# EAGLE design Backplane (EAGLE 9.5.2)

## Sheet 1 of 2
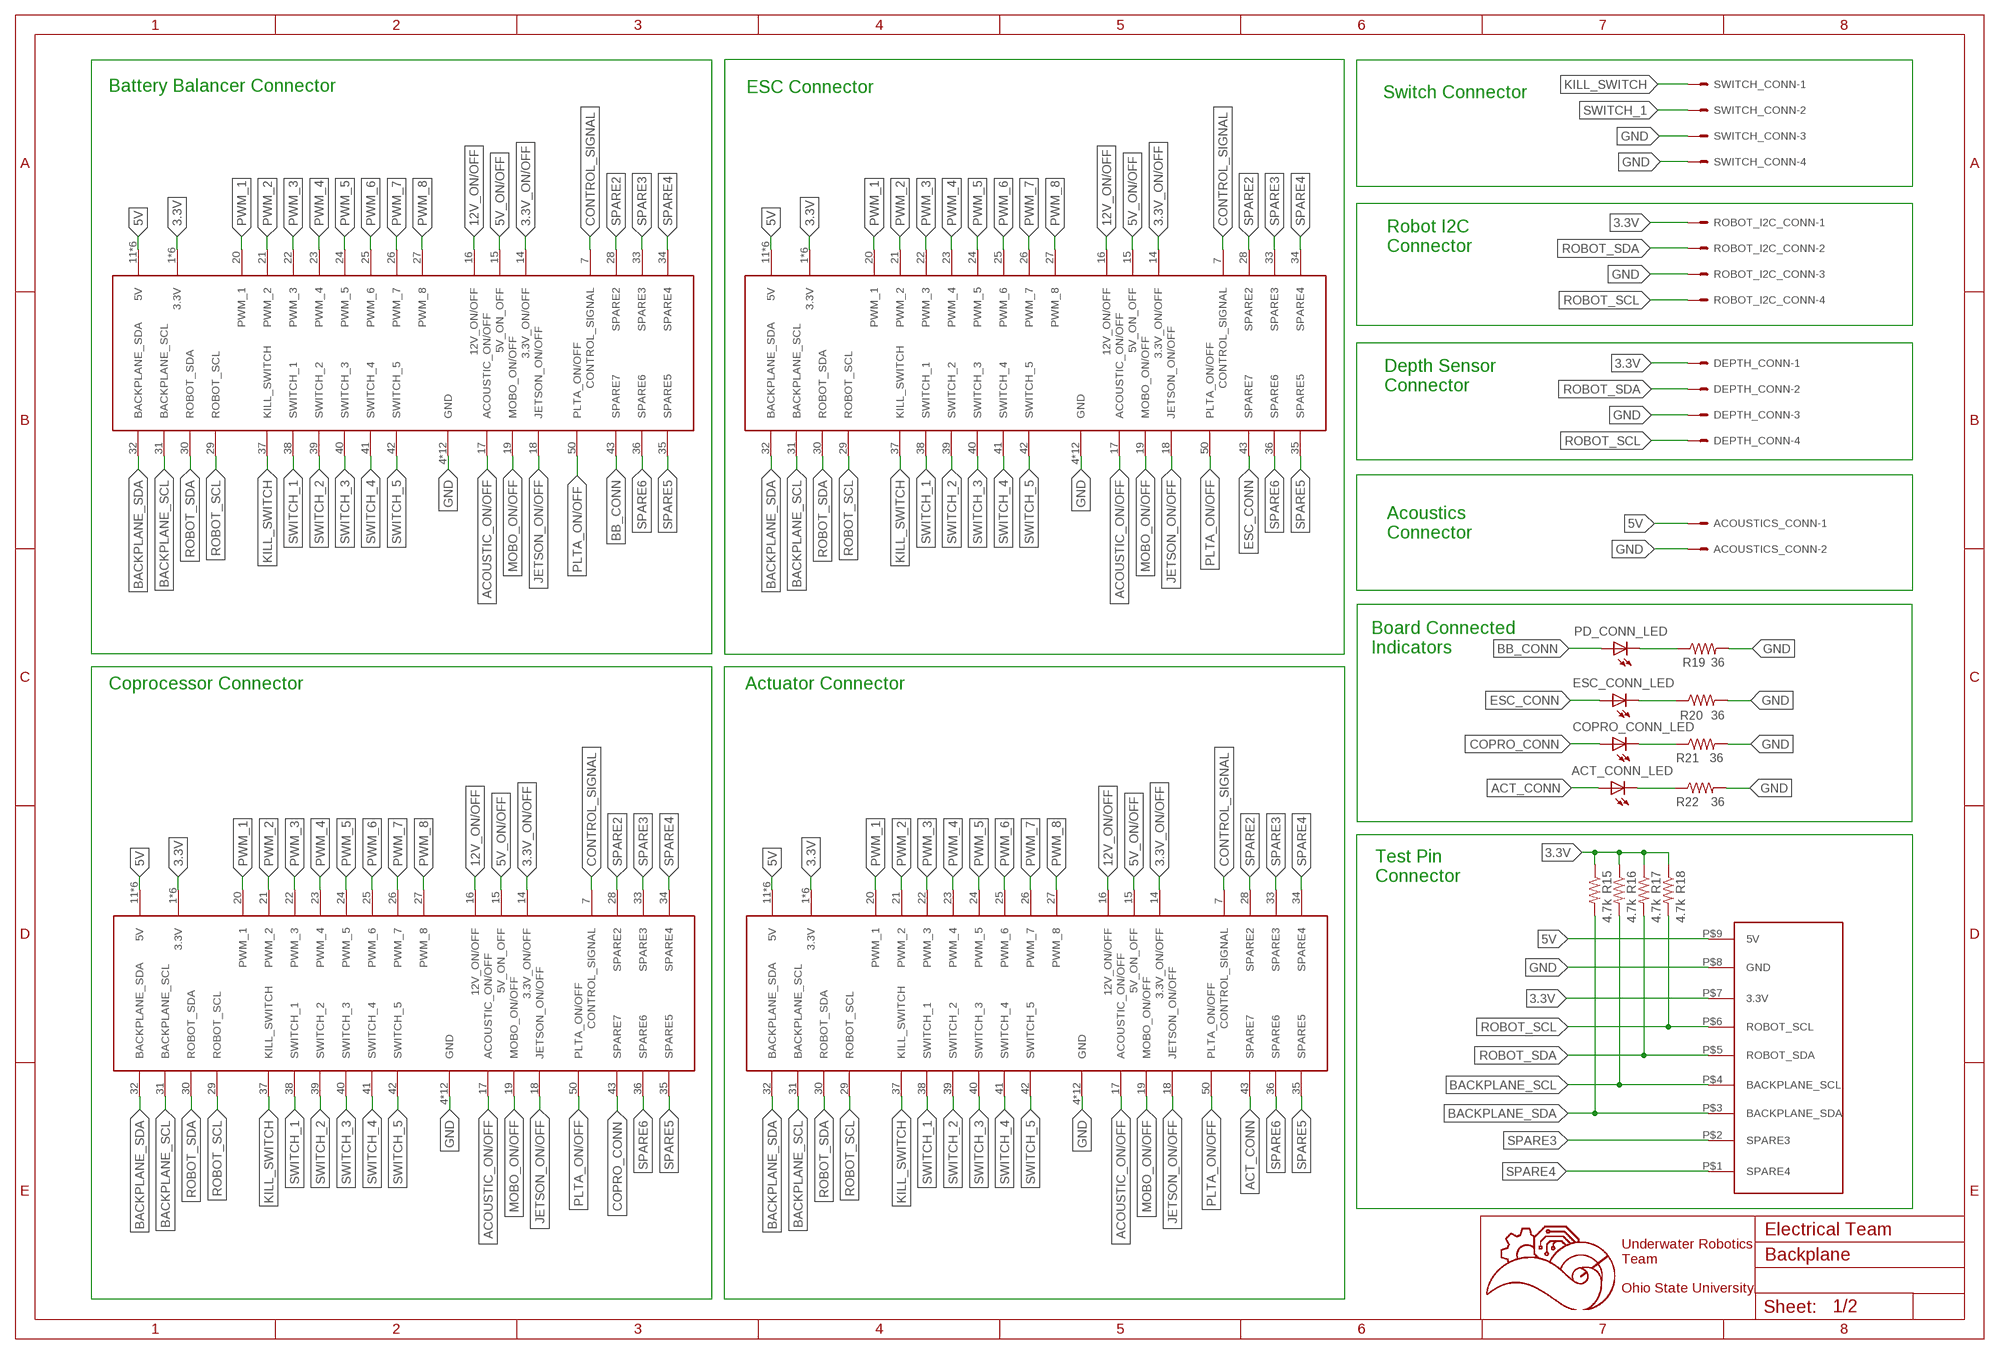
[diagram p0: schematic, sheet 1]

### Parts
ACOUSTICS_CONN  555X-2V  [5566-2]
ACT_CONN_LED  LEDCHIP-LED0603  [CHIP-LED0603]
COPRO_CONN_LED  LEDCHIP-LED0603  [CHIP-LED0603]
DEPTH_CONN  555X-4V  [5566-4]
ESC_CONN_LED  LEDCHIP-LED0603  [CHIP-LED0603]
PD_CONN_LED  LEDCHIP-LED0603  [CHIP-LED0603]
R15  4.7k  R-US_R0603  [R0603]
R16  4.7k  R-US_R0603  [R0603]
R17  4.7k  R-US_R0603  [R0603]
R18  4.7k  R-US_R0603  [R0603]
R19  36  R-US_R0603  [R0603]
R20  36  R-US_R0603  [R0603]
R21  36  R-US_R0603  [R0603]
R22  36  R-US_R0603  [R0603]
ROBOT_I2C_CONN  555X-4V  [5566-4]
SWITCH_CONN  555X-4V  [5566-4]
TESTPIN_CONNECTOR  929870-01-09_4  [929852-01-09_1ROW]
U$1  5530843-FEMALE  [5530843-6-BACKPLANEMATE]
U$2  5530843-FEMALE  [5530843-6-BACKPLANEMATE]
U$3  5530843-FEMALE  [5530843-6-BACKPLANEMATE]
U$4  5530843-FEMALE  [5530843-6-BACKPLANEMATE]

### Nets
3.3V: DEPTH_CONN.1 R15.1 R16.1 R17.1 R18.1 ROBOT_I2C_CONN.1 TESTPIN_CONNECTOR.P$7(3.3V) U$1.1(3.3V) U$1.2(3.3V) U$1.3(3.3V) U$1.54(3.3V) U$1.55(3.3V) U$1.56(3.3V) U$2.1(3.3V) U$2.2(3.3V) U$2.3(3.3V) U$2.54(3.3V) U$2.55(3.3V) U$2.56(3.3V) U$3.1(3.3V) U$3.2(3.3V) U$3.3(3.3V) U$3.54(3.3V) U$3.55(3.3V) U$3.56(3.3V) U$4.1(3.3V) U$4.2(3.3V) U$4.3(3.3V) U$4.54(3.3V) U$4.55(3.3V) U$4.56(3.3V)
3.3V_ON/OFF: U$1.14(3.3V_ON/OFF) U$2.14(3.3V_ON/OFF) U$3.14(3.3V_ON/OFF) U$4.14(3.3V_ON/OFF)
5V: ACOUSTICS_CONN.1 TESTPIN_CONNECTOR.P$9(5V) U$1.11(5V) U$1.12(5V) U$1.13(5V) U$1.44(5V) U$1.45(5V) U$1.46(5V) U$2.11(5V) U$2.12(5V) U$2.13(5V) U$2.44(5V) U$2.45(5V) U$2.46(5V) U$3.11(5V) U$3.12(5V) U$3.13(5V) U$3.44(5V) U$3.45(5V) U$3.46(5V) U$4.11(5V) U$4.12(5V) U$4.13(5V) U$4.44(5V) U$4.45(5V) U$4.46(5V)
5V_ON/OFF: U$1.15(5V_ON_OFF) U$2.15(5V_ON_OFF) U$3.15(5V_ON_OFF) U$4.15(5V_ON_OFF)
12V_ON/OFF: U$1.16(12V_ON/OFF) U$2.16(12V_ON/OFF) U$3.16(12V_ON/OFF) U$4.16(12V_ON/OFF)
ACOUSTIC_ON/OFF: U$1.17(ACOUSTIC_ON/OFF) U$2.17(ACOUSTIC_ON/OFF) U$3.17(ACOUSTIC_ON/OFF) U$4.17(ACOUSTIC_ON/OFF)
ACT_CONN: ACT_CONN_LED.A U$4.43(SPARE7)
BACKPLANE_SCL: R16.2 TESTPIN_CONNECTOR.P$4(BACKPLANE_SCL) U$1.31(BACKPLANE_SCL) U$2.31(BACKPLANE_SCL) U$3.31(BACKPLANE_SCL) U$4.31(BACKPLANE_SCL)
BACKPLANE_SDA: R15.2 TESTPIN_CONNECTOR.P$3(BACKPLANE_SDA) U$1.32(BACKPLANE_SDA) U$2.32(BACKPLANE_SDA) U$3.32(BACKPLANE_SDA) U$4.32(BACKPLANE_SDA)
BB_CONN: PD_CONN_LED.A U$1.43(SPARE7)
CONTROL_SIGNAL: U$1.7(CONTROL_SIGNAL) U$2.7(CONTROL_SIGNAL) U$3.7(CONTROL_SIGNAL) U$4.7(CONTROL_SIGNAL)
COPRO_CONN: COPRO_CONN_LED.A U$3.43(SPARE7)
ESC_CONN: ESC_CONN_LED.A U$2.43(SPARE7)
GND: ACOUSTICS_CONN.2 DEPTH_CONN.3 R19.2 R20.2 R21.2 R22.2 ROBOT_I2C_CONN.3 SWITCH_CONN.3 SWITCH_CONN.4 TESTPIN_CONNECTOR.P$8(GND) U$1.4(GND) U$1.5(GND) U$1.6(GND) U$1.8(GND) U$1.9(GND) U$1.10(GND) U$1.47(GND) U$1.48(GND) U$1.49(GND) U$1.51(GND) U$1.52(GND) U$1.53(GND) U$2.4(GND) U$2.5(GND) U$2.6(GND) U$2.8(GND) U$2.9(GND) U$2.10(GND) U$2.47(GND) U$2.48(GND) U$2.49(GND) U$2.51(GND) U$2.52(GND) U$2.53(GND) U$3.4(GND) U$3.5(GND) U$3.6(GND) U$3.8(GND) U$3.9(GND) U$3.10(GND) U$3.47(GND) U$3.48(GND) U$3.49(GND) U$3.51(GND) U$3.52(GND) U$3.53(GND) U$4.4(GND) U$4.5(GND) U$4.6(GND) U$4.8(GND) U$4.9(GND) U$4.10(GND) U$4.47(GND) U$4.48(GND) U$4.49(GND) U$4.51(GND) U$4.52(GND) U$4.53(GND)
JETSON_ON/OFF: U$1.18(JETSON_ON/OFF) U$2.18(JETSON_ON/OFF) U$3.18(JETSON_ON/OFF) U$4.18(JETSON_ON/OFF)
KILL_SWITCH: SWITCH_CONN.1 U$1.37(KILL_SWITCH) U$2.37(KILL_SWITCH) U$3.37(KILL_SWITCH) U$4.37(KILL_SWITCH)
MOBO_ON/OFF: U$1.19(MOBO_ON/OFF) U$2.19(MOBO_ON/OFF) U$3.19(MOBO_ON/OFF) U$4.19(MOBO_ON/OFF)
N$12: PD_CONN_LED.C R19.1
N$13: ESC_CONN_LED.C R20.1
N$14: COPRO_CONN_LED.C R21.1
N$15: ACT_CONN_LED.C R22.1
PLTA_ON/OFF: U$1.50(PLTA_ON/OFF) U$2.50(PLTA_ON/OFF) U$3.50(PLTA_ON/OFF) U$4.50(PLTA_ON/OFF)
PWM_1: U$1.20(PWM_1) U$2.20(PWM_1) U$3.20(PWM_1) U$4.20(PWM_1)
PWM_2: U$1.21(PWM_2) U$2.21(PWM_2) U$3.21(PWM_2) U$4.21(PWM_2)
PWM_3: U$1.22(PWM_3) U$2.22(PWM_3) U$3.22(PWM_3) U$4.22(PWM_3)
PWM_4: U$1.23(PWM_4) U$2.23(PWM_4) U$3.23(PWM_4) U$4.23(PWM_4)
PWM_5: U$1.24(PWM_5) U$2.24(PWM_5) U$3.24(PWM_5) U$4.24(PWM_5)
PWM_6: U$1.25(PWM_6) U$2.25(PWM_6) U$3.25(PWM_6) U$4.25(PWM_6)
PWM_7: U$1.26(PWM_7) U$2.26(PWM_7) U$3.26(PWM_7) U$4.26(PWM_7)
PWM_8: U$1.27(PWM_8) U$2.27(PWM_8) U$3.27(PWM_8) U$4.27(PWM_8)
ROBOT_SCL: DEPTH_CONN.4 R18.2 ROBOT_I2C_CONN.4 TESTPIN_CONNECTOR.P$6(ROBOT_SCL) U$1.29(ROBOT_SCL) U$2.29(ROBOT_SCL) U$3.29(ROBOT_SCL) U$4.29(ROBOT_SCL)
ROBOT_SDA: DEPTH_CONN.2 R17.2 ROBOT_I2C_CONN.2 TESTPIN_CONNECTOR.P$5(ROBOT_SDA) U$1.30(ROBOT_SDA) U$2.30(ROBOT_SDA) U$3.30(ROBOT_SDA) U$4.30(ROBOT_SDA)
SPARE2: U$1.28(SPARE2) U$2.28(SPARE2) U$3.28(SPARE2) U$4.28(SPARE2)
SPARE3: TESTPIN_CONNECTOR.P$2(SPARE3) U$1.33(SPARE3) U$2.33(SPARE3) U$3.33(SPARE3) U$4.33(SPARE3)
SPARE4: TESTPIN_CONNECTOR.P$1(SPARE4) U$1.34(SPARE4) U$2.34(SPARE4) U$3.34(SPARE4) U$4.34(SPARE4)
SPARE5: U$1.35(SPARE5) U$2.35(SPARE5) U$3.35(SPARE5) U$4.35(SPARE5)
SPARE6: U$1.36(SPARE6) U$2.36(SPARE6) U$3.36(SPARE6) U$4.36(SPARE6)
SWITCH_1: SWITCH_CONN.2 U$1.38(SWITCH_1) U$2.38(SWITCH_1) U$3.38(SWITCH_1) U$4.38(SWITCH_1)
SWITCH_2: U$1.39(SWITCH_2) U$2.39(SWITCH_2) U$3.39(SWITCH_2) U$4.39(SWITCH_2)
SWITCH_3: U$1.40(SWITCH_3) U$2.40(SWITCH_3) U$3.40(SWITCH_3) U$4.40(SWITCH_3)
SWITCH_4: U$1.41(SWITCH_4) U$2.41(SWITCH_4) U$3.41(SWITCH_4) U$4.41(SWITCH_4)
SWITCH_5: U$1.42(SWITCH_5) U$2.42(SWITCH_5) U$3.42(SWITCH_5) U$4.42(SWITCH_5)

### Notes on the sheet
- Battery Balancer Connector | ESC Connector
- Switch Connector
- Robot I2C
  Connector
- Depth Sensor
  Connector
- Acoustics
  Connector
- Board Connected 
  Indicators
- Coprocessor Connector | Actuator Connector
- Test Pin
  Connector
- Electrical Team
- Underwater Robotics
  Team
  
  Ohio State University

## Sheet 2 of 2
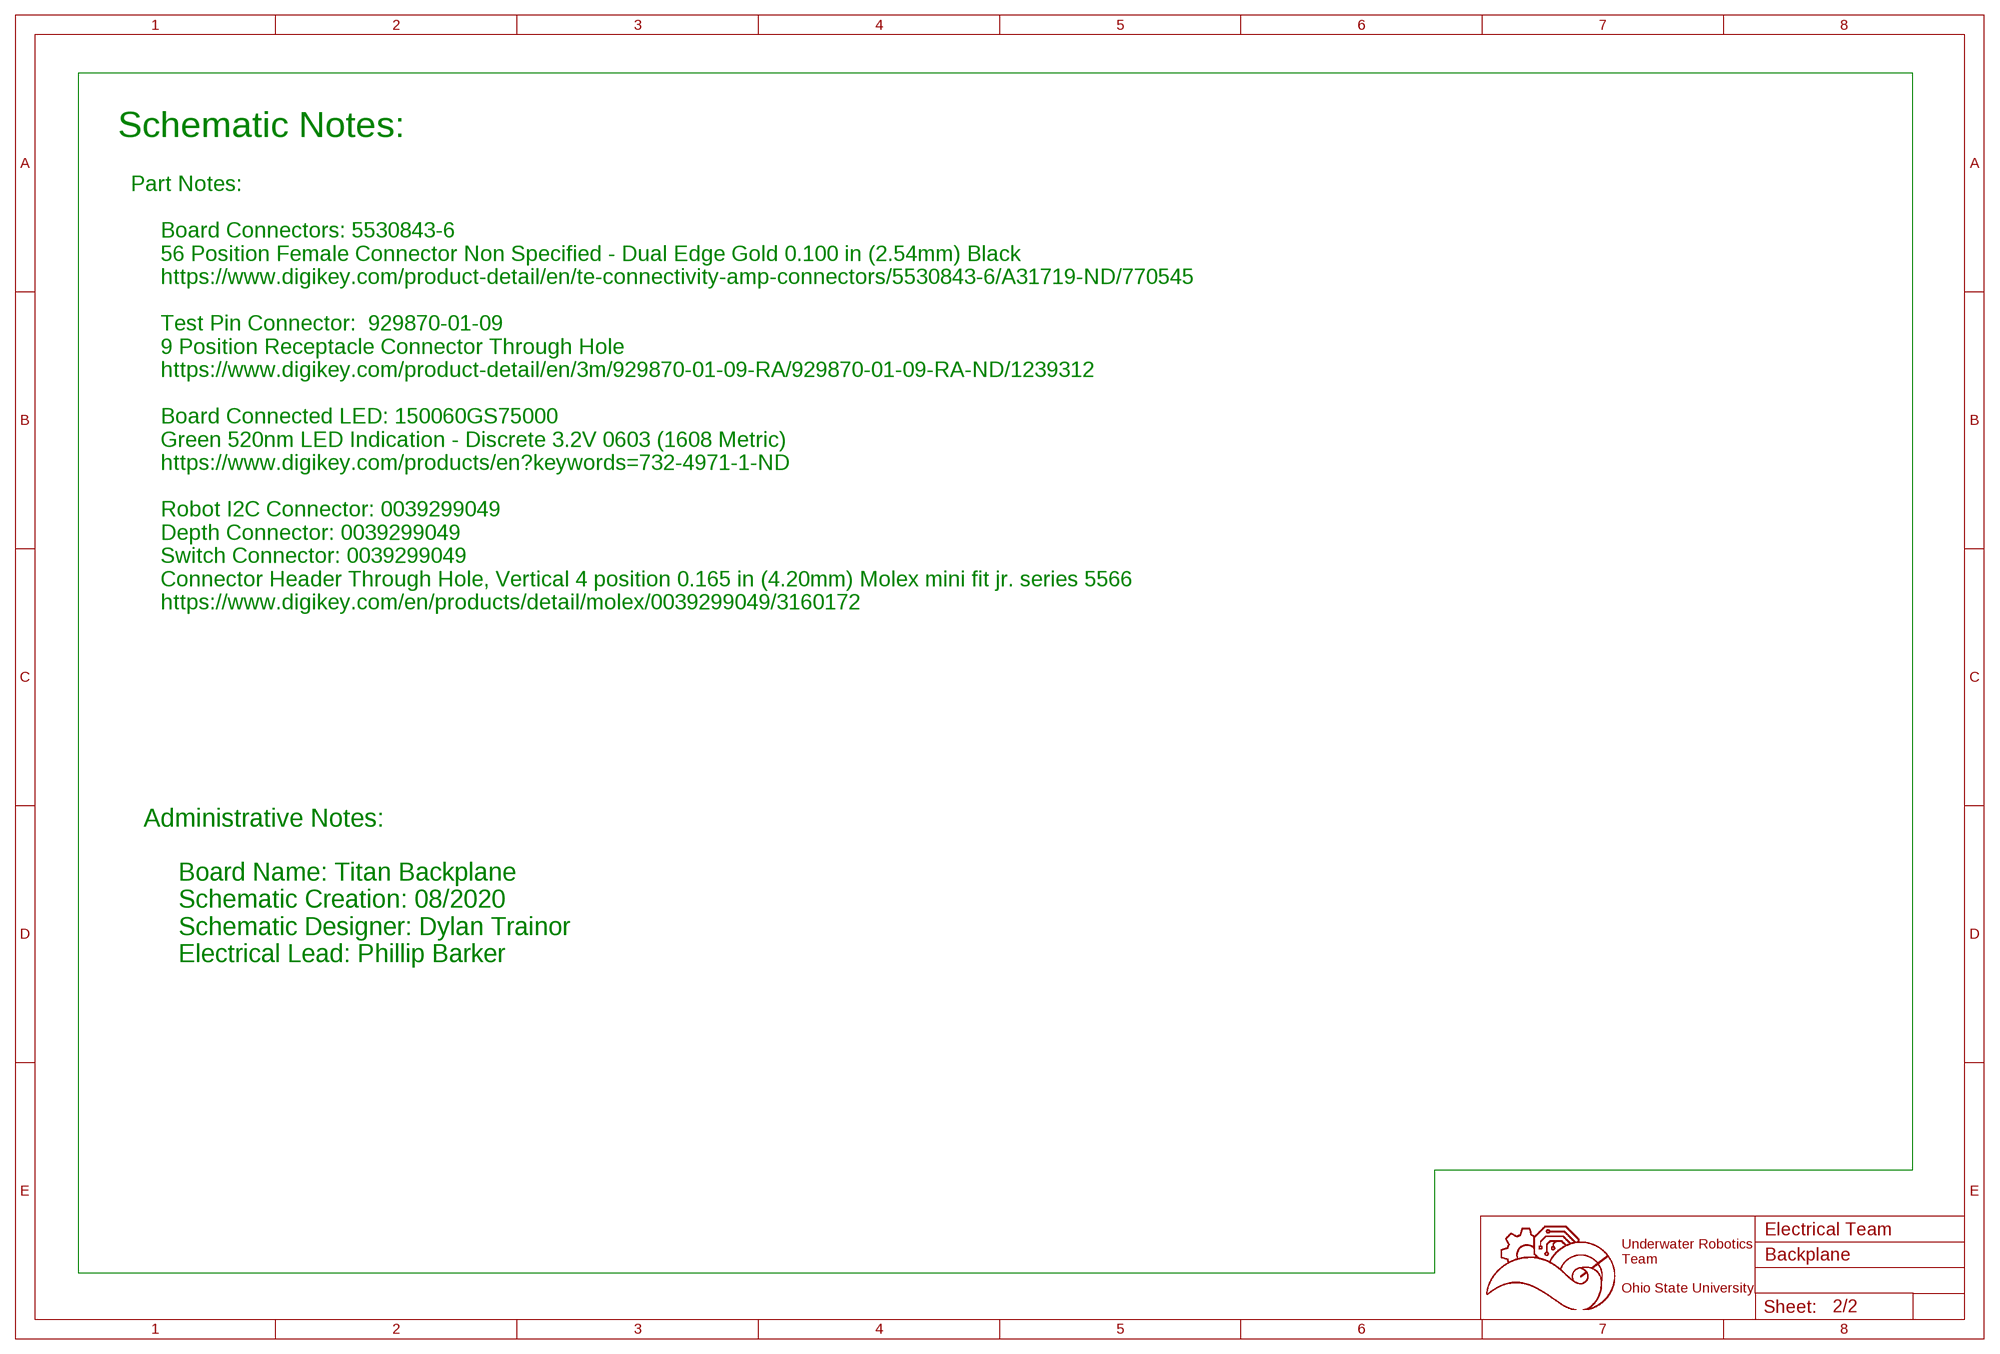
[diagram p1: schematic, sheet 2]

### Notes on the sheet
- Schematic Notes:
- Part Notes:
  
       Board Connectors: 5530843-6
       56 Position Female Connector Non Specified - Dual Edge Gold 0.100 in (2.54mm) Black
       https://www.digikey.com/product-detail/en/te-connectivity-amp-connectors/5530843-6/A31719-ND/770545
  
       Test Pin Connector:  929870-01-09
       9 Position Receptacle Connector Through Hole
       https://www.digikey.com/product-detail/en/3m/929870-01-09-RA/929870-01-09-RA-ND/1239312
  
       Board Connected LED: 150060GS75000
       Green 520nm LED Indication - Discrete 3.2V 0603 (1608 Metric)
       https://www.digikey.com/products/en?keywords=732-4971-1-ND
  
       Robot I2C Connector: 0039299049
       Depth Connector: 0039299049
       Switch Connector: 0039299049
       Connector Header Through Hole, Vertical 4 position 0.165 in (4.20mm) Molex mini fit jr. series 5566
       https://www.digikey.com/en/products/detail/molex/0039299049/3160172
- Administrative Notes:
  
       Board Name: Titan Backplane
       Schematic Creation: 08/2020
       Schematic Designer: Dylan Trainor
       Electrical Lead: Phillip Barker
- Electrical Team
- Underwater Robotics
  Team
  
  Ohio State University

## Library data of the parts
ACOUSTICS_CONN = con-molex-2:555X-2: Mini FIT connector 2 way
ACT_CONN_LED COPRO_CONN_LED ESC_CONN_LED PD_CONN_LED = led:LED: LED OSRAM: - CHIPLED LG R971, LG N971, LY N971, LG Q971, LY Q971, LO R971, LY R971 LH N974, LH R974 LS Q976, LO Q976, LY Q976 LO Q996 - Hyper CHIPLED LW Q18S LB Q993, LB Q99A, LB R99A - SideLED LS A670, LO A670, LY A670, LG A670, LP A670 LB A673, LV A673, LT A673, LW A673 LH A674 LY A675 LS A676, LA A676, LO A676, LY A676, LW A676 LS A679, LY A679, LG A679 - Hyper Micro SIDELED® LS Y876, LA Y876, LO Y876, LY Y876 LT Y87S - SmartLED LW L88C, LW L88S LB L89C, LB L89S, LG L890 LS L89K, LO L89K, LY L89K LS L896, LA L896, LO L896, LY L896 - TOPLED LS T670, LO T670, LY T670, LG T670, LP T670 LSG T670, LSP T670, LSY T670, LOP T670, LYG T670 LG T671, LOG T671, LSG T671 LB T673, LV T673, LT T673, LW T673 LH T674 LS T676, LA T676, LO T676, LY T676, LB T676, LH T676, LSB T676, LW T676 LB T67C, LV T67C, LT T67C, LS T67K, LO T67K, LY T67K, LW E67C LS E67B, LA E67B, LO E67B, LY E67B, LB E67C, LV E67C, LT E67C LW T67C LS T679, LY T679, LG T679 LS T770, LO T770, LY T770, LG T770, LP T770 LB T773, LV T773, LT T773, LW T773 LH T774 LS E675, LA E675, LY E675, LS T675 LS T776, LA T776, LO T776, LY T776, LB T776 LHGB T686 LT T68C, LB T68C - Hyper Mini TOPLED® LB M676 - Mini TOPLED Santana® LG M470 LS M47K, LO M47K, LY M47K Source: http://www.osram.convergy.de LUXEON: - LUMILED® LXK2-PW12-R00, LXK2-PW12-S00, LXK2-PW14-U00, LXK2-PW14-V00 LXK2-PM12-R00, LXK2-PM12-S00, LXK2-PM14-U00 LXK2-PE12-Q00, LXK2-PE12-R00, LXK2-PE12-S00, LXK2-PE14-T00, LXK2-PE14-U00 LXK2-PB12-K00, LXK2-PB12-L00, LXK2-PB12-M00, LXK2-PB14-N00, LXK2-PB14-P00, LXK2-PB14-Q00 LXK2-PR12-L00, LXK2-PR12-M00, LXK2-PR14-Q00, LXK2-PR14-R00 LXK2-PD12-Q00, LXK2-PD12-R00, LXK2-PD12-S00 LXK2-PH12-R00, LXK2-PH12-S00 LXK2-PL12-P00, LXK2-PL12-Q00, LXK2-PL12-R00 Source: www.luxeon.com KINGBRIGHT: KA-3528ASYC Source: www.kingbright.com
DEPTH_CONN ROBOT_I2C_CONN SWITCH_CONN = con-molex-2:555X-4: Mini FIT connector 4 way
R15-R22 = rcl:R-US_: RESISTOR, American symbol; SPICEPREFIX: R
TESTPIN_CONNECTOR = 3M_929852_Connector:929870-01-09_4
U$1-U$4 = 5530843-6:5530843-FEMALE

## Board
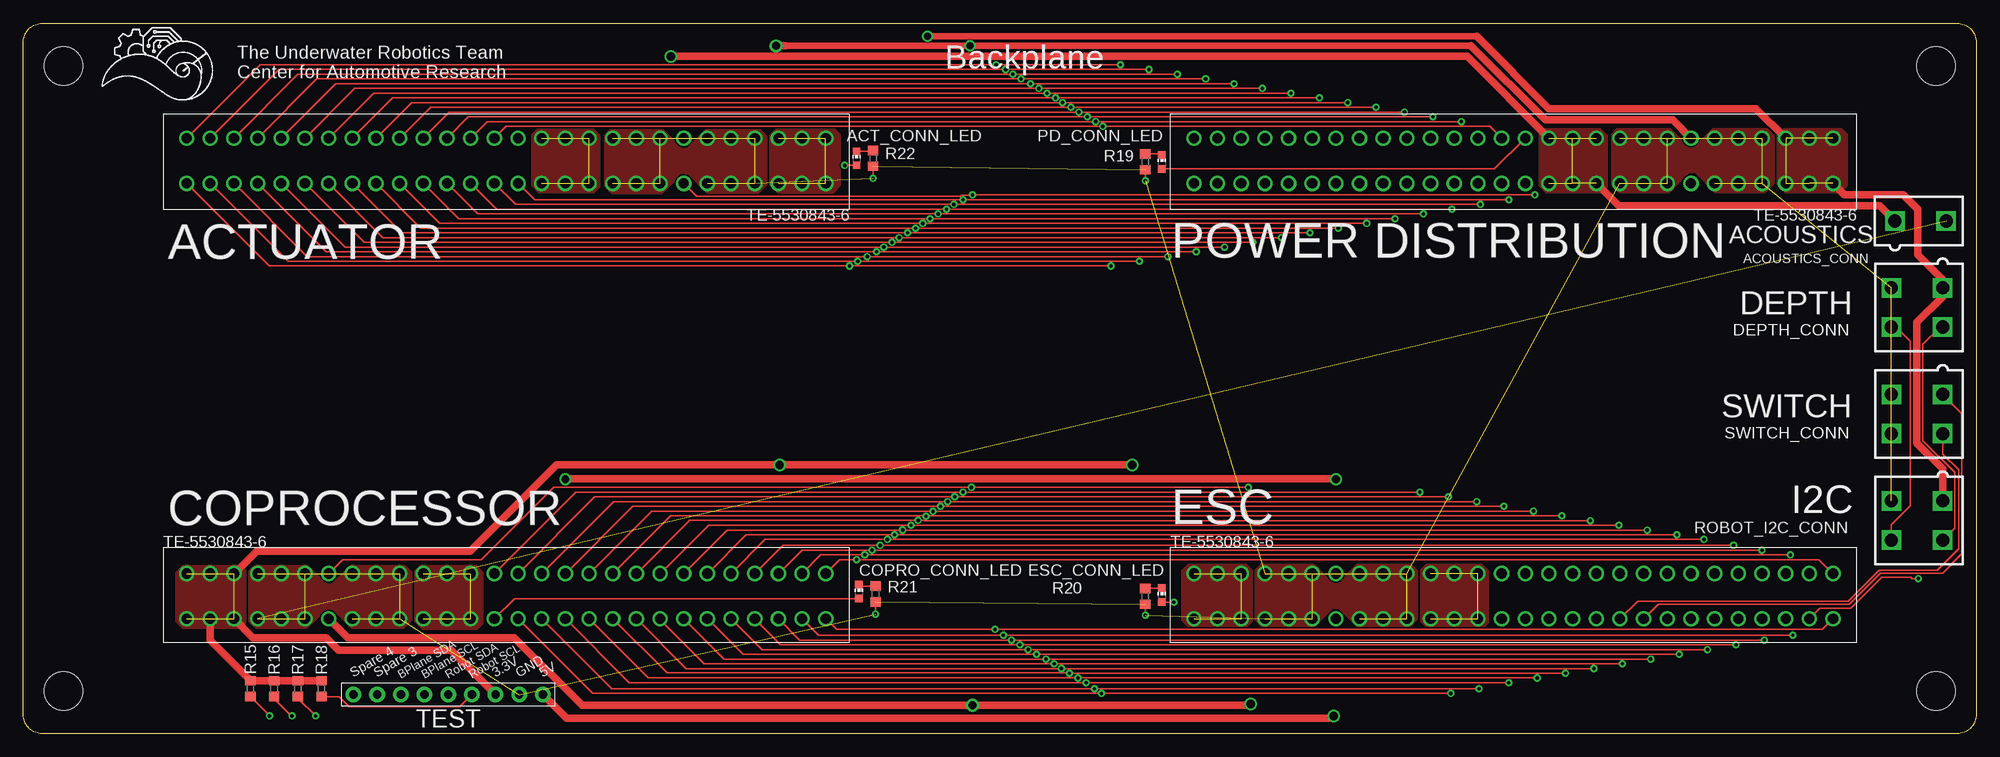
[diagram p2: board, top side]
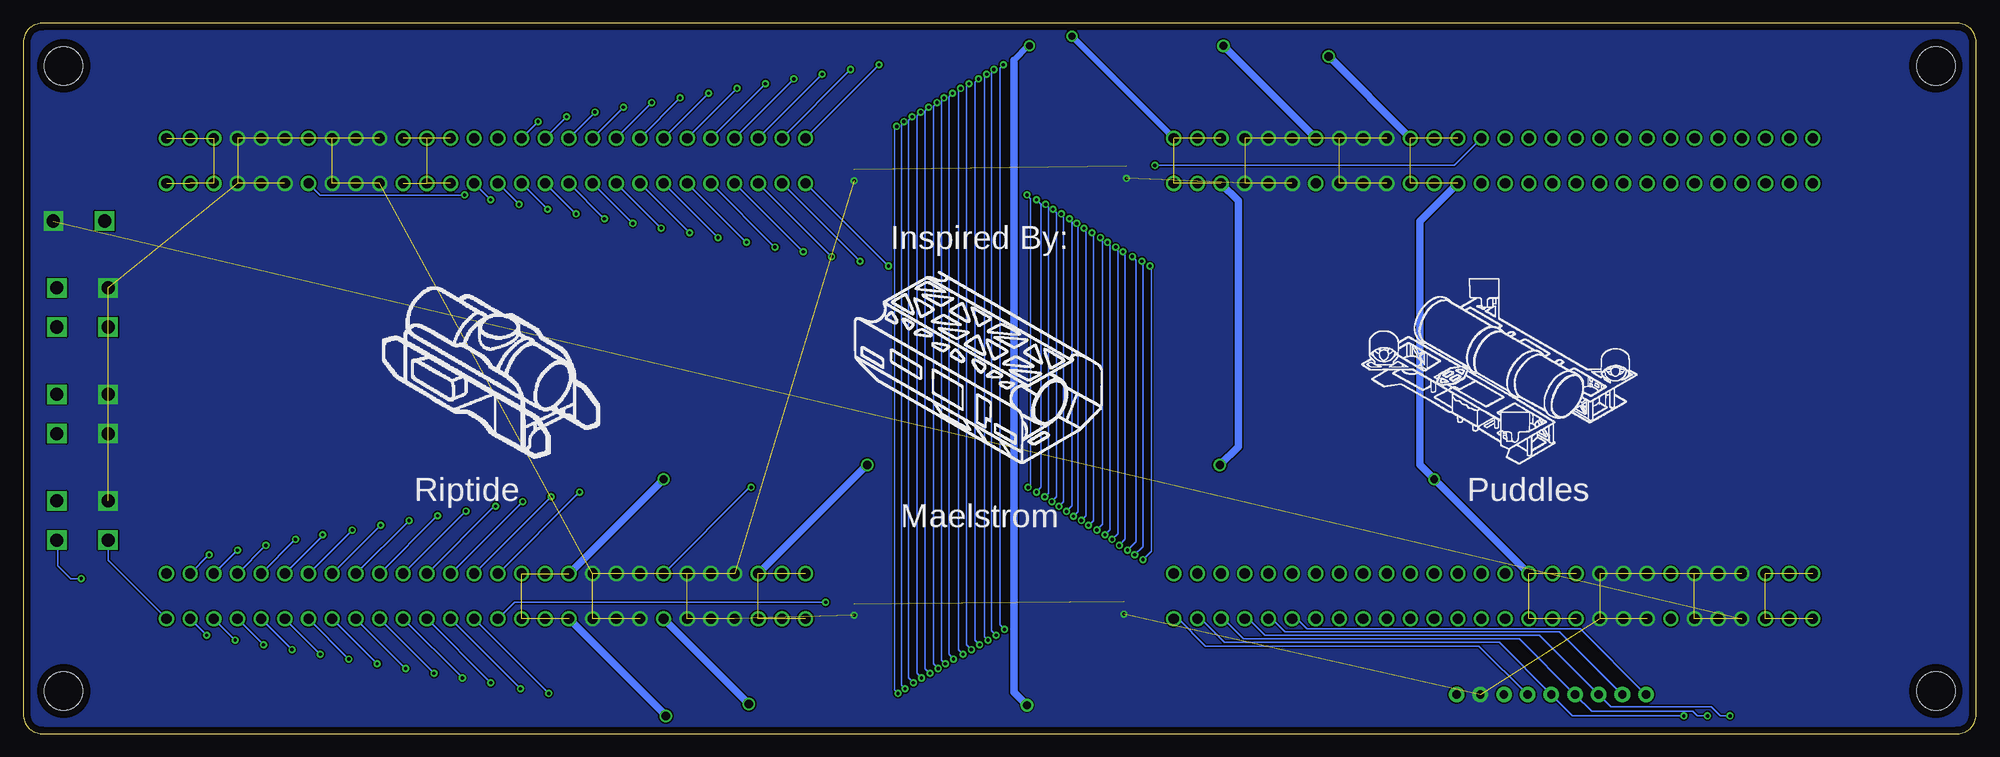
[diagram p3: board, bottom side, seen from below]

Size 209.55 x 76.2 mm. Coordinates in mm from the lower left corner, seen from the top.
Outline: 207.52,0 2.03,0 arc-90 0,2.03 0,74.17 arc-90 2.03,76.2 207.52,76.2 arc-90 209.55,74.17 209.55,2.03 arc-90 207.52,0
Copper layers (1*16): Top 0.035mm / dielectric 1.5mm / Bottom 0.035mm
Design rules "default *": minimum track width 6mil, minimum drill 0.35mm, track to track 6mil, track to pad 6mil, pad to pad 6mil, via to via 6mil, smd to smd 6mil, copper to edge 30mil, drill to drill 6mil, minimum pad ring 10mil, minimum via ring 8mil, stop-mask expansion 4mil, vias tented up to drill 0mil, thermal gap 10mil
Holes 4.17 mm at 4.32,71.63 205.23,71.63 205.23,4.57 4.32,4.57

### Footprints (pad centres in the part's own frame; a part is rotated, then mirrored left to right if it is on the bottom)
5566-2 = drill 1.4 square: 1 0,-2.75; 2 0,2.75
CHIP-LED0603 = smd 0.8 x 0.8: A 0,-0.75; C 0,0.75
5566-4 = drill 1.4 square: 1 2.1,-2.75; 2 -2.1,-2.75; 3 2.1,2.75; 4 -2.1,2.75
R0603 = smd 1 x 1.1: 1 -0.85,0; 2 0.85,0
929852-01-09_1ROW = drill 0.889 pad 1.676: P$1 1.27,1.27; P$2 3.81,1.27; P$3 6.35,1.27; P$4 8.89,1.27; P$5 11.43,1.27; P$6 13.97,1.27; P$7 16.51,1.27; P$8 19.05,1.27; P$9 21.59,1.27
5530843-6-BACKPLANEMATE = drill 1.092: 1 0,4.851; 2 2.54,4.851; 3 5.08,4.851; 4 7.62,4.851; 5 10.16,4.851; 6 12.7,4.851; 7 15.24,4.851; 8 17.78,4.851; 9 20.32,4.851; 10 22.86,4.851; 11 25.4,4.851; 12 27.94,4.851; 13 30.48,4.851; 14 33.02,4.851; 15 35.56,4.851; 16 38.1,4.851; 17 40.64,4.851; 18 43.18,4.851; 19 45.72,4.851; 20 48.26,4.851; 21 50.8,4.851; 22 53.34,4.851; 23 55.88,4.851; 24 58.42,4.851; 25 60.96,4.851; 26 63.5,4.851; 27 66.04,4.851; 28 68.58,4.851; 29 68.58,0; 30 66.04,0; 31 63.5,0; 32 60.96,0; 33 58.42,0; 34 55.88,0; 35 53.34,0; 36 50.8,0; 37 48.26,0; 38 45.72,0; 39 43.18,0; 40 40.64,0; 41 38.1,0; 42 35.56,0; 43 33.02,0; 44 30.48,0; 45 27.94,0; 46 25.4,0; 47 22.86,0; 48 20.32,0; 49 17.78,0; 50 15.24,0; 51 12.7,0; 52 10.16,0; 53 7.62,0; 54 5.08,0; 55 2.54,0; 56 0,0

### Placement (x,y rotation side)
ACOUSTICS_CONN  203.58,54.99 270 top
ACT_CONN_LED  89.41,61.72 0 top
COPRO_CONN_LED  89.66,15.24 0 top
DEPTH_CONN  203.2,45.72 90 top
ESC_CONN_LED  122.17,14.86 0 top
PD_CONN_LED  122.17,61.34 0 top
R15  24.38,4.83 270 top
R16  26.92,4.83 270 top
R17  29.46,4.83 270 top
R18  32,4.83 270 top
R19  120.4,61.34 270 top
R20  120.4,14.73 270 top
R21  91.44,14.99 270 top
R22  91.19,61.72 270 top
ROBOT_I2C_CONN  203.2,22.86 90 top
SWITCH_CONN  203.2,34.29 90 top
TESTPIN_CONNECTOR  34.16,2.92 0 top
U$1  194.18,63.88 180 top
U$2  125.6,12.32 0 top
U$3  17.53,12.32 0 top
U$4  86.11,63.88 180 top

### Tracks (layer width: path | path; a pad name or v marks a point on that pad's centre or on a via)
3.3V  (via drill 0.76, 0.9)  (20 unrouted)
  Top 0.711: 155.96,74.8 v97.03,74.8
  Top 0.813: TESTPIN_CONNECTOR.P$7 45.9,8.96 33.83,8.96 32.48,10.31 24.62,10.31 U$3.54 | R18.1 R17.1 R16.1 R15.1 20.07,9.99 U$3.55 | U$3.3 25.02,19.58 47.96,19.58 57.21,28.83 v81.15,28.83 v119,28.83 | U$1.54 185.93,67.06 163.7,67.06 155.96,74.8 | U$1.1 195.4,57.81 201.7,57.81 203.28,56.23 203.28,51.38 205.95,48.71 DEPTH_CONN.1 205.95,46.89 203.2,44.14 203.2,31.16 205.95,28.41 ROBOT_I2C_CONN.1
  Bottom 0.711: U$4.56 v97.03,74.8
  Bottom 0.813: U$4.3 81.03,58.99 79.18,57.14 79.18,30.8 v81.15,28.83 | v119,28.83 119.02,28.83 U$2.3
  pour Top (no thermals): 188.98,64.9 195.07,64.9 195.71,64.26 195.71,58.8 194.94,58.04 189.1,58.04 188.21,58.93 188.21,64.14
  pour Top (no thermals): 17.14,18.03 23.24,18.03 23.88,17.4 23.88,11.94 23.24,11.3 17.14,11.3 16.38,12.06 16.38,17.27
  pour Top (no thermals): 80.9,64.9 87,64.9 87.63,64.26 87.63,58.8 86.87,58.04 81.03,58.04 80.14,58.93 80.14,64.14
  pour Top (no thermals): 125.09,18.16 131.19,18.16 131.83,17.53 131.83,12.06 131.06,11.3 125.22,11.3 124.33,12.19 124.33,17.4
3.3V_ON/OFF  (via drill 0.35)
  Top 0.152: v149.86,25.91 v100.84,25.91 59.28,25.91 U$3.14 | v159.41,57.28 v100.84,57.28 54.84,57.28 U$4.14
  Bottom 0.152: U$2.14 149.88,25.91 v149.86,25.91 | v100.84,25.91 100.33,26.42 100.33,56.77 v100.84,57.28 | U$1.14 v159.41,57.28
5V  (via drill 0.85, 0.9)  (20 unrouted)
  Top 0.813: TESTPIN_CONNECTOR.P$9 58.29,1.65 140.34,1.65 v140.59,1.91 | v140.84,27.3 140.79,27.35 58.37,27.35 58.32,27.3 v58.17,27.3 | U$1.44 154.94,72.64 v69.47,72.64 | ACOUSTICS_CONN.1 199.18,56.64 171.2,56.64 168.81,59.03 U$1.11
  Bottom 0.813: U$2.46 v140.59,1.91 | 58.14,27.3 59.69,28.85 59.69,54.97 U$4.13 | U$2.11 140.87,27.3 v140.84,27.3 | v58.17,27.3 58.14,27.3 | 58.14,27.3 U$3.13 | v69.47,72.64 U$4.46
  pour Top (no thermals): 162.69,64.26 163.32,64.9 169.16,64.9 169.93,64.14 169.93,58.67 169.29,58.04 163.45,58.04 162.69,58.8
  pour Top (no thermals): 54.61,64.26 55.24,64.9 61.09,64.9 61.85,64.14 61.85,58.67 61.21,58.04 55.37,58.04 54.61,58.8
  pour Top (no thermals): 149.99,17.53 150.62,18.16 156.46,18.16 157.23,17.4 157.23,11.94 156.59,11.3 150.75,11.3 149.99,12.06
  pour Top (no thermals): 42.04,12.06 42.04,17.4 42.67,18.03 48.51,18.03 49.28,17.27 49.28,11.81 48.64,11.18 42.93,11.18
5V_ON/OFF  (via drill 0.35)
  Top 0.152: v152.91,25.4 v99.95,25.4 61.32,25.4 U$3.15 | v156.34,56.77 v99.85,56.77 52.81,56.77 U$4.15
  Bottom 0.152: U$2.15 152.93,25.4 v152.91,25.4 | U$1.15 156.36,56.77 v156.34,56.77 | v99.95,25.4 99.57,25.78 99.57,56.49 v99.85,56.77
12V_ON/OFF  (via drill 0.35)
  Top 0.152: v155.96,24.89 v155.95,24.89 v99.19,24.89 63.35,24.89 U$3.16 | v153.29,56.26 v99.06,56.26 50.77,56.26 U$4.16
  Bottom 0.152: U$2.16 155.98,24.89 v155.96,24.89 | U$1.16 153.31,56.26 v153.29,56.26 | v99.19,24.89 98.68,25.4 98.68,55.88 v99.06,56.26
ACOUSTIC_ON/OFF  (via drill 0.35)
  Top 0.152: v158.88,24.38 v98.42,24.38 65.39,24.38 65.38,24.38 U$3.17 | v150.24,55.75 v98.17,55.75 48.74,55.75 U$4.17
  Bottom 0.152: U$2.17 159.03,24.38 v158.88,24.38 | U$1.17 150.27,55.75 v150.24,55.75 | v98.42,24.38 97.92,24.88 97.92,55.5 v98.17,55.75
ACT_CONN  (via drill 0.35)
  Top 0.152: ACT_CONN_LED.A 89.4,60.96 v88.14,60.96
  Bottom 0.152: v88.14,60.96 56.01,60.96 U$4.43
BACKPLANE_SCL  (via drill 0.35)
  Top 0.152: v186.82,10.04 v106.05,10.04 v106.05,10.03 83.31,10.03 U$3.31 | v28.83,1.91 28.77,1.91 26.92,3.75 R16.2 | v123.83,70.74 v106.19,70.74 v106.18,70.73 29.46,70.73 U$4.31
  Bottom 0.152: U$2.31 v186.82,10.04 | v28.83,1.91 29.93,1.91 30.41,2.38 41.25,2.38 TESTPIN_CONNECTOR.P$4 49.02,10.16 78.61,10.16 80.77,12.32 U$3.31 | U$1.31 v123.83,70.74 | v106.05,10.03 106.43,10.41 106.43,70.48 v106.18,70.73
BACKPLANE_SDA  (via drill 0.35)
  Top 0.152: v183.77,9.53 v106.93,9.53 81.28,9.53 U$3.32 | R15.2 26.42,1.94 v26.42,1.91 | v126.87,70.23 v107.06,70.23 31.5,70.23 U$4.32
  Bottom 0.152: U$2.32 v183.77,9.53 | v26.42,1.91 27.43,1.91 28.4,2.87 39.18,2.87 40.5,4.19 TESTPIN_CONNECTOR.P$3 46.86,10.54 76.33,10.54 78.11,12.32 U$3.32 | U$1.32 v126.87,70.23 | v106.93,9.53 107.44,10.03 107.44,69.85 v107.06,70.23
BB_CONN
  Top 0.152: PD_CONN_LED.A 157.87,60.59 U$1.43
CONTROL_SIGNAL  (via drill 0.35)
  Top 0.152: v131.44,26.42 v101.73,26.42 56.9,26.42 49.15,18.67 34.27,18.67 U$3.7 | U$4.7 72.24,57.66 100.54,57.66 100.64,57.76 101.83,57.76 v101.85,57.78 v162.2,57.78
  Bottom 0.152: U$2.7 131.6,26.42 v131.44,26.42 | v101.85,57.78 101.47,57.4 101.47,26.67 v101.73,26.42 | U$1.7 177.67,57.76 162.23,57.76 v162.2,57.78
COPRO_CONN
  Top 0.152: COPRO_CONN_LED.A 52.72,14.49 U$3.43
ESC_CONN  (via drill 0.35)
  Top 0.152: ESC_CONN_LED.A v123.43,14.11 v123.44,14.1
  Bottom 0.152: v123.44,14.1 156.84,14.1 U$2.43
GND  (via drill 0.35)  (57 unrouted)
  Top 0.152: R22.2 v91.19,59.56 | R19.2 v120.4,59.31 | R20.2 v120.4,12.7 | R21.2 v91.44,12.83
  pour Top (no thermals): 170.43,64.26 171.07,64.9 176.66,64.9 178.69,62.87 179.32,62.87 181.36,64.9 187.07,64.9 187.83,64.14 187.83,59.05 186.82,58.04 181.61,58.04 179.45,60.2 178.69,60.2 176.53,58.04 171.32,58.04 170.43,58.93
  pour Top (no thermals): 24.26,17.4 24.89,18.03 30.48,18.03 32.51,16 33.15,16 35.18,18.03 40.89,18.03 41.66,17.27 41.66,12.19 40.77,11.3 35.31,11.3 33.27,13.34 32.51,13.34 30.35,11.3 25.02,11.3 24.26,12.06
  pour Top (no thermals): 62.36,64.14 62.99,64.77 68.58,64.77 70.61,62.74 71.25,62.74 73.28,64.77 78.99,64.77 79.76,64.01 79.76,58.93 78.74,57.91 73.53,57.91 71.37,60.07 70.61,60.07 68.45,57.91 63.25,57.91 62.36,58.8
  pour Top (no thermals): 132.21,17.53 132.84,18.16 138.43,18.16 140.46,16.13 141.1,16.13 143.13,18.16 148.84,18.16 149.61,17.4 149.61,12.32 148.59,11.3 143.38,11.3 141.22,13.46 140.46,13.46 138.3,11.3 133.1,11.3 132.21,12.19
  pour Bottom (no thermals): 0.25,74.55 1.65,75.95 207.65,75.95 209.17,74.42 209.17,1.65 207.77,0.25 1.78,0.25 0.25,1.78
JETSON_ON/OFF  (via drill 0.35)
  Top 0.152: v162.05,23.88 162.01,23.84 v97.62,23.84 97.58,23.88 67.41,23.88 U$3.18 | v147.19,55.24 v97.28,55.24 46.71,55.24 U$4.18
  Bottom 0.152: U$2.18 162.08,23.88 v162.05,23.88 | U$1.18 147.22,55.24 v147.19,55.24 | v97.28,55.24 97.03,54.99 97.03,24.43 v97.62,23.84
KILL_SWITCH  (via drill 0.35)
  Top 0.152: v168.53,6.99 v111.38,6.99 71.12,6.99 U$3.37 | U$2.37 173.91,12.32 175.46,13.88 195.93,13.88 199.28,17.23 205.95,17.23 208.03,19.3 208.03,34.31 SWITCH_CONN.1 | v142.11,67.69 v111.51,67.69 41.66,67.69 U$4.37
  Bottom 0.152: U$2.37 v168.53,6.99 | U$1.37 v142.11,67.69 | v111.38,6.99 111.89,7.49 111.89,67.31 v111.51,67.69
MOBO_ON/OFF  (via drill 0.35)
  Top 0.152: v165.1,23.37 97.83,23.37 97.82,23.36 96.89,23.36 v96.85,23.32 96.8,23.37 69.45,23.37 U$3.19 | v144.15,54.74 140.21,54.74 140.2,54.73 v96.51,54.73 44.69,54.73 U$4.19
  Bottom 0.152: U$2.19 165.12,23.37 v165.1,23.37 | U$1.19 144.17,54.74 v144.15,54.74 | v96.85,23.32 96.39,23.78 96.39,54.61 v96.51,54.73
N$12
  Top 0.152: R19.1 122.07,62.19 PD_CONN_LED.C
N$13
  Top 0.152: ESC_CONN_LED.C 122.15,15.58 R20.1
N$14
  Top 0.152: COPRO_CONN_LED.C 89.82,15.84 R21.1
N$15
  Top 0.152: ACT_CONN_LED.C 91.09,62.47 R22.1
PLTA_ON/OFF  (via drill 0.76, 0.9)
  Top 0.711: 155.35,73.79 v101.6,73.79 81.79,73.79
  Top 0.813: v131.7,3.17 131.57,3.05 v101.85,3.05 59.94,3.05 52.68,10.31 34.78,10.31 U$3.50 | v80.77,73.79 81.79,73.79 | 155.35,73.79 163.3,65.84 176.99,65.84 U$1.50
  Bottom 0.711: 103.25,72.26 101.73,73.79 v101.6,73.79
  Bottom 0.813: U$2.50 v131.7,3.17 | U$4.50 v80.77,73.79 | 103.25,72.26 103.25,4.45 v101.85,3.05
PWM_1  (via drill 0.35)
  Top 0.152: v168.15,22.86 97.07,22.86 97.05,22.84 96.65,22.84 96.63,22.87 v96.02,22.87 71.48,22.87 U$3.20 | v141.1,54.23 95.76,54.23 v95.74,54.21 42.66,54.21 U$4.20
  Bottom 0.152: U$2.20 168.17,22.86 v168.15,22.86 | U$1.20 141.12,54.23 v141.1,54.23 | v95.74,54.21 95.5,53.98 95.5,23.38 v96.02,22.87
PWM_2  (via drill 0.35)
  Top 0.152: v171.2,22.35 v95.25,22.35 73.51,22.35 U$3.21 | v138.05,53.72 v94.87,53.72 40.62,53.72 U$4.21
  Bottom 0.152: U$2.21 171.22,22.35 v171.2,22.35 | U$1.21 138.07,53.72 v138.05,53.72 | v95.25,22.35 94.74,22.86 94.74,53.59 v94.87,53.72
PWM_3  (via drill 0.35)
  Top 0.152: v174.24,21.84 v94.36,21.84 75.54,21.84 U$3.22 | v135,53.21 v93.98,53.21 38.58,53.21 U$4.22
  Bottom 0.152: U$2.22 174.27,21.84 v174.24,21.84 | U$1.22 135.03,53.21 v135,53.21 | v93.98,53.21 93.73,52.96 93.73,22.48 v94.36,21.84
PWM_4  (via drill 0.35)
  Top 0.152: v177.42,21.34 v177.41,21.34 v93.48,21.34 77.58,21.34 U$3.23 | v131.95,52.7 124.84,52.7 124.83,52.7 v93.21,52.7 36.56,52.7 U$4.23
  Bottom 0.152: U$2.23 177.42,21.23 v177.42,21.34 | U$1.23 131.98,52.7 v131.95,52.7 | v93.48,21.34 92.96,21.86 92.96,52.45 v93.21,52.7
PWM_5  (via drill 0.35)
  Top 0.152: v180.34,20.83 v92.71,20.83 79.6,20.83 U$3.24 | v128.91,52.2 v92.33,52.2 34.52,52.2 U$4.24
  Bottom 0.152: U$2.24 180.37,20.83 v180.34,20.83 | U$1.24 128.93,52.2 v128.91,52.2 | v92.33,52.2 92.08,51.94 92.08,21.46 v92.71,20.83
PWM_6  (via drill 0.35)
  Top 0.152: v183.51,20.19 v91.95,20.19 81.51,20.19 U$3.25 | v125.86,51.69 115.44,51.69 115.44,51.68 v91.56,51.68 32.49,51.68 U$4.25
  Bottom 0.152: U$2.25 183.54,20.19 v183.51,20.19 | U$1.25 125.88,51.69 v125.86,51.69 | v91.95,20.19 91.31,20.83 91.31,51.44 v91.56,51.68
PWM_7  (via drill 0.35)
  Top 0.152: v186.56,19.68 v186.55,19.69 v91.06,19.69 83.55,19.69 U$3.26 | v122.81,51.18 v90.55,51.18 30.45,51.18 U$4.26
  Bottom 0.152: U$2.26 186.59,19.68 v186.56,19.68 | U$1.26 122.83,51.18 v122.81,51.18 | v90.55,51.18 90.17,50.8 90.17,20.59 v91.06,19.69
PWM_8  (via drill 0.35)
  Top 0.152: v189.61,19.17 v189.61,19.18 v90.29,19.18 85.57,19.18 U$3.27 | v119.76,50.67 103.33,50.67 103.32,50.69 102.67,50.69 102.66,50.67 v89.53,50.67 28.42,50.67 U$4.27
  Bottom 0.152: U$2.27 189.64,19.17 v189.61,19.17 | U$1.27 119.79,50.67 v119.76,50.67 | v90.29,19.18 89.41,20.06 89.41,50.55 v89.53,50.67
ROBOT_SCL  (via drill 0.35)
  Top 0.152: U$2.29 193.04,11.18 v104.27,11.18 87.25,11.18 U$3.29 | R18.2 33.88,3.98 34.99,2.87 46.81,2.87 TESTPIN_CONNECTOR.P$6 | v117.73,71.75 v104.39,71.75 25.4,71.75 U$4.29 | DEPTH_CONN.4 200.96,43.62 202.49,42.09 202.49,24.45 200.45,22.41 ROBOT_I2C_CONN.4
  Bottom 0.152: TESTPIN_CONNECTOR.P$6 53.34,9.4 82.68,9.4 85.6,12.32 U$3.29 | U$1.29 v117.73,71.75 | v104.27,11.18 104.78,11.68 104.78,71.37 v104.39,71.75 | U$2.29 200.44,18.57 200.44,20.75 ROBOT_I2C_CONN.4
ROBOT_SDA  (via drill 0.35)
  Top 0.152: v189.87,10.54 v105.16,10.54 85.34,10.54 U$3.30 | R17.2 29.46,3.81 v31.37,1.91 | v120.78,71.25 v105.41,71.25 27.43,71.25 U$4.30 | U$2.30 192.79,13.46 196.09,13.46 199.43,16.8 202.53,16.8 202.69,16.64 v203.33,16.64 | DEPTH_CONN.2 205.7,43.62 203.84,41.76 203.84,31.42 207.23,28.03 207.23,22.04 ROBOT_I2C_CONN.2
  Bottom 0.152: v189.87,10.54 U$2.30 191.64,12.4 | v31.37,1.91 43.31,1.91 TESTPIN_CONNECTOR.P$5 51.18,9.78 80.64,9.78 83.19,12.32 U$3.30 | U$1.30 v120.78,71.25 | v105.16,10.54 105.66,11.05 105.66,70.99 v105.41,71.25 | v203.33,16.64 204.47,16.64 205.87,18.03 205.87,20.68 ROBOT_I2C_CONN.2
SPARE2  (via drill 0.35)
  Top 0.152: U$2.28 192.68,18.67 v89.41,18.67 87.61,18.67 U$3.28 | v116.71,50.16 v88.65,50.16 26.39,50.16 U$4.28
  Bottom 0.152: U$1.28 116.74,50.16 v116.71,50.16 | v88.65,50.16 88.52,50.04 88.52,19.56 v89.41,18.67
SPARE3  (via drill 0.35)
  Top 0.152: v180.72,9.02 v107.82,9.02 79.25,9.02 U$3.33 | v129.92,69.72 v108.08,69.72 33.53,69.72 U$4.33
  Bottom 0.152: U$2.33 v180.72,9.02 | TESTPIN_CONNECTOR.P$2 44.7,10.92 74.17,10.92 75.56,12.32 U$3.33 | U$1.33 v129.92,69.72 | v107.82,9.02 108.33,9.53 108.33,69.47 v108.08,69.72
SPARE4  (via drill 0.35)
  Top 0.152: v177.67,8.51 v108.71,8.51 77.22,8.51 U$3.34 | v132.97,69.22 v108.97,69.22 35.56,69.22 U$4.34
  Bottom 0.152: U$2.34 v177.67,8.51 | TESTPIN_CONNECTOR.P$1 42.47,11.23 71.81,11.23 72.9,12.32 U$3.34 | U$1.34 v132.97,69.22 | v108.71,8.51 109.22,9.02 109.22,68.96 v108.97,69.22
SPARE5  (via drill 0.35)
  Top 0.152: v174.62,8 v109.73,8 75.18,8 U$3.35 | v136.02,68.71 v109.86,68.71 37.59,68.71 U$4.35
  Bottom 0.152: U$2.35 v174.62,8 | U$1.35 v136.02,68.71 | v109.73,8 110.24,8.51 110.24,68.33 v109.86,68.71
SPARE6  (via drill 0.35)
  Top 0.152: U$3.36 68.33,12.19 73.02,7.5 73.03,7.5 v110.61,7.5 v110.62,7.49 v171.58,7.49 | v139.06,68.2 v110.74,68.2 39.62,68.2 U$4.36
  Bottom 0.152: U$1.36 v139.06,68.2 | v110.74,68.2 111,67.94 111,7.87 110.62,7.5 v110.61,7.5 | U$2.36 v171.58,7.49
SWITCH_1  (via drill 0.35)
  Top 0.152: v165.48,6.48 v112.27,6.48 112.2,6.48 112.17,6.5 69.06,6.5 U$3.38 | v145.16,67.18 v112.39,67.18 43.69,67.18 U$4.38 | SWITCH_CONN.2 205.95,29.99 207.66,28.28 207.66,19.83 205.37,17.54 199.16,17.54 195.84,14.22 173.23,14.22 U$2.38
  Bottom 0.152: U$2.38 v165.48,6.48 | U$1.38 v145.16,67.18 | v112.27,6.48 112.78,6.99 112.78,66.8 v112.39,67.18
SWITCH_2  (via drill 0.35)
  Top 0.152: v162.43,5.97 v113.16,5.97 67.06,5.97 U$3.39 | v148.21,66.67 v113.26,66.67 45.72,66.67 U$4.39
  Bottom 0.152: U$2.39 v162.43,5.97 | U$1.39 v148.21,66.67 | v113.16,5.97 113.67,6.48 113.67,66.27 v113.26,66.67
SWITCH_3  (via drill 0.35)
  Top 0.152: v159.38,5.46 v114.05,5.46 65.02,5.46 U$3.40 | v151.26,66.17 v114.17,66.17 47.75,66.17 U$4.40
  Bottom 0.152: U$2.40 v159.38,5.46 | U$1.40 v151.26,66.17 | v114.05,5.46 114.55,5.97 114.55,65.79 v114.17,66.17
SWITCH_4  (via drill 0.35)
  Top 0.152: v156.21,4.83 v114.94,4.83 63.12,4.83 U$3.41 | v154.31,65.66 v115.06,65.66 49.78,65.66 U$4.41
  Bottom 0.152: U$2.41 v156.21,4.83 | U$1.41 v154.31,65.66 | v114.94,4.83 115.32,5.21 115.32,65.41 v115.06,65.66
SWITCH_5  (via drill 0.35)
  Top 0.152: v153.16,4.32 v115.7,4.32 61.09,4.32 U$3.42 | U$1.42 157.35,65.15 v115.84,65.15 v115.83,65.14 51.81,65.14 U$4.42
  Bottom 0.152: v153.16,4.32 U$2.42 | v115.7,4.32 116.08,4.7 116.08,64.9 v115.83,65.14

### Text on the board
tPlace: Backplane | The Underwater Robotics Team / Center for Automotive Research
bPlace: Inspired By: | Puddles | Riptide | Maelstrom | C:/Users/Flipt/Downloads/puddles-outline-2.bmp
tNames: ACOUSTICS | ACTUATOR | POWER DISTRIBUTION | DEPTH | SWITCH | I2C | COPROCESSOR | ESC | Spare 4 | Spare 3 | BPlane SDA | BPlane SCL | Robot SDA | Robot SCL | 3.3V | GND | 5V | TEST